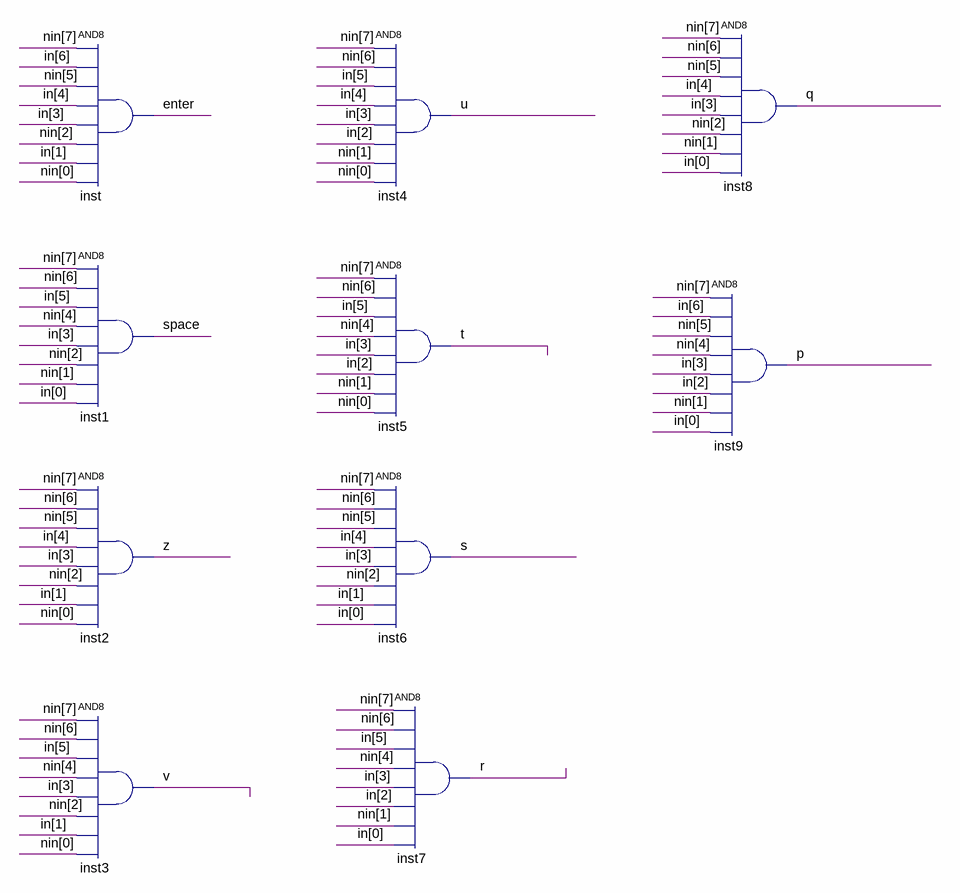
[diagram p0: schematic sheet]
// Quartus schematic slova.bdf as structural Verilog: 10 symbols, 0 pins
module slova (
);

  wire enter, p, q, r, s, space, t, u, v, z;
  wire [6:0] in;
  wire [7:0] nin;

  and inst (enter, nin[7], in[6], nin[5], in[4], in[3], nin[2], in[1], nin[0]);
  and inst1 (space, nin[7], nin[6], in[5], nin[4], in[3], nin[2], nin[1], in[0]);
  and inst2 (z, nin[7], nin[6], nin[5], in[4], in[3], nin[2], in[1], nin[0]);
  and inst3 (v, nin[7], nin[6], in[5], nin[4], in[3], nin[2], in[1], nin[0]);
  and inst4 (u, nin[7], nin[6], in[5], in[4], in[3], in[2], nin[1], nin[0]);
  and inst5 (t, nin[7], nin[6], in[5], nin[4], in[3], in[2], nin[1], nin[0]);
  and inst6 (s, nin[7], nin[6], nin[5], in[4], in[3], nin[2], in[1], in[0]);
  and inst7 (r, nin[7], nin[6], in[5], nin[4], in[3], in[2], nin[1], in[0]);
  and inst8 (q, nin[7], nin[6], nin[5], in[4], in[3], nin[2], nin[1], in[0]);
  and inst9 (p, nin[7], in[6], nin[5], nin[4], in[3], in[2], nin[1], in[0]);
endmodule
